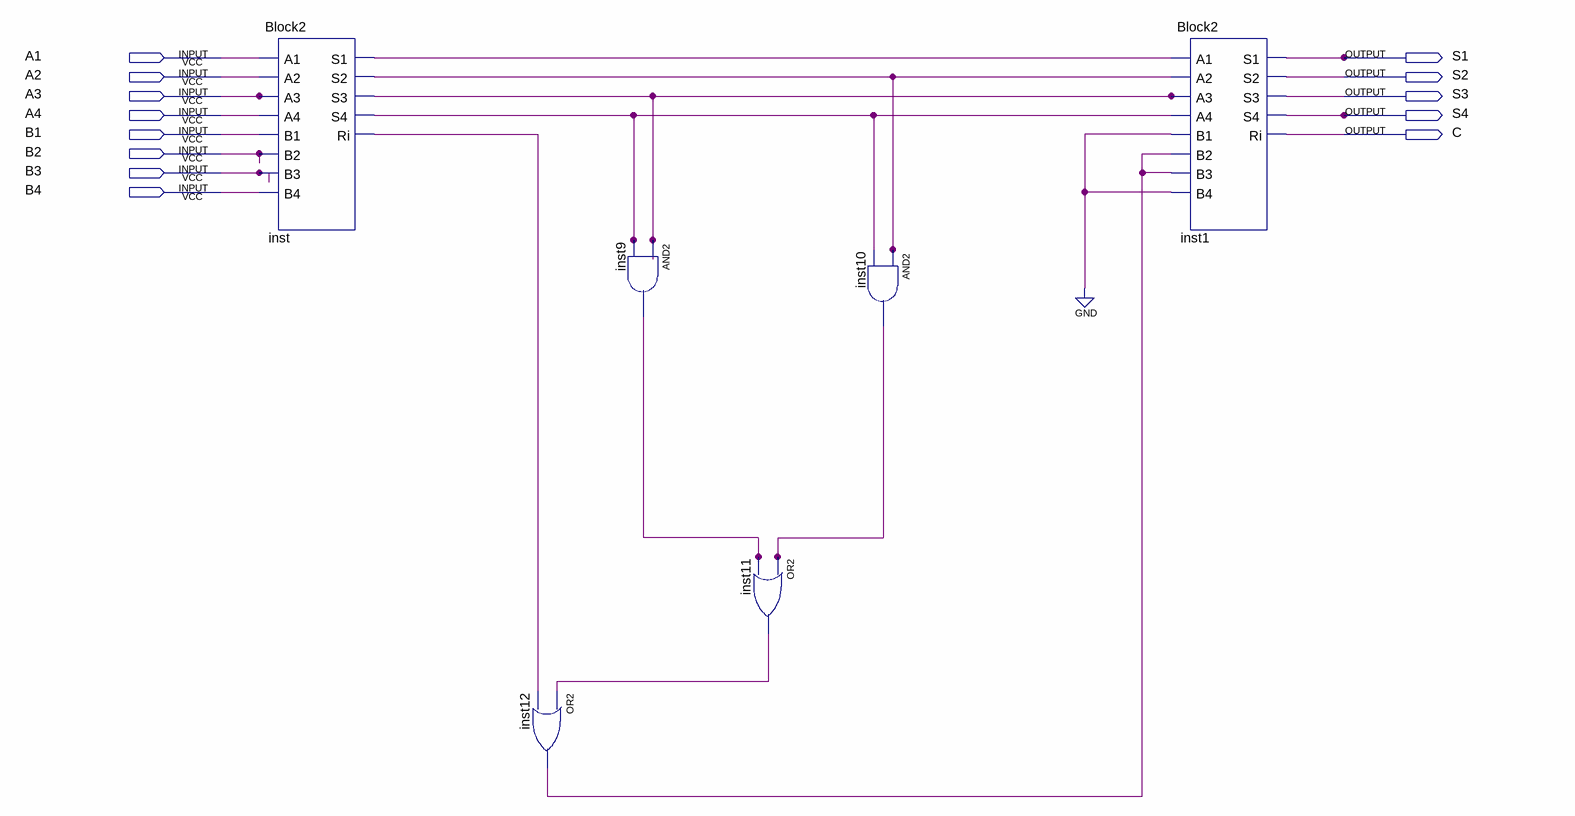
[diagram p0: schematic sheet]
// Quartus schematic Block11.bdf as structural Verilog: 6 symbols, 13 pins
module Block11 (
  input  A1,
  input  A2,
  input  A3,
  input  A4,
  input  B1,
  input  B2,
  input  B3,
  input  B4,
  output S1,
  output S2,
  output S3,
  output S4,
  output C
);

  wire inst9_out, inst10_out, inst11_out, inst12_out, inst_ri, inst_s1, inst_s2, inst_s3, inst_s4;

  Block2 inst (
    .A1(A1), .A2(A2), .A3(A3), .A4(A4), .B1(B1), .B2(B2), .B3(B3), .B4(B4), .S1(inst_s1), .S2(inst_s2),
    .S3(inst_s3), .S4(inst_s4), .Ri(inst_ri));
  or inst12 (inst12_out, inst11_out, inst_ri);
  and inst9 (inst9_out, inst_s3, inst_s4);
  or inst11 (inst11_out, inst10_out, inst9_out);
  and inst10 (inst10_out, inst_s2, inst_s4);
  Block2 inst1 (
    .A1(inst_s1), .A2(inst_s2), .A3(inst_s3), .A4(inst_s4), .B1(1'b0), .B2(inst12_out), .B3(inst12_out),
    .B4(1'b0), .S1(S1), .S2(S2), .S3(S3), .S4(S4), .Ri(C));
endmodule
